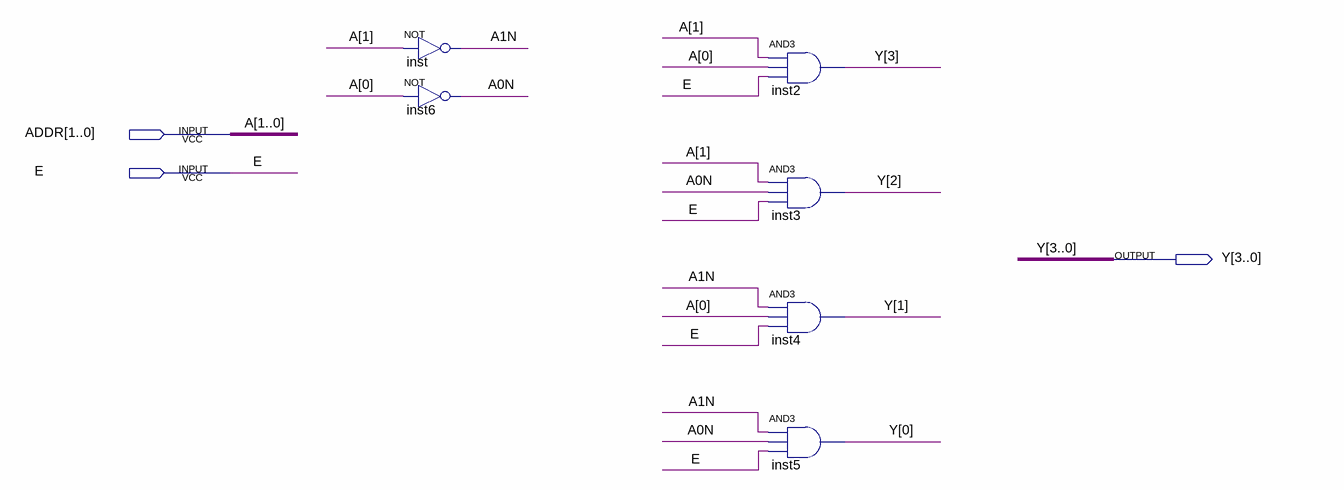
[diagram p0: schematic sheet]
// Quartus schematic DECODER_2_TO_4.bdf as structural Verilog: 6 symbols, 3 pins
module DECODER_2_TO_4 (
  input  [1:0] ADDR,
  input  E,
  output [3:0] Y
);

  wire A0N, A1N;

  not inst (A1N, ADDR[1]);
  not inst6 (A0N, ADDR[0]);
  and inst2 (Y[3], ADDR[1], ADDR[0], E);
  and inst3 (Y[2], ADDR[1], A0N, E);
  and inst4 (Y[1], A1N, ADDR[0], E);
  and inst5 (Y[0], A1N, A0N, E);

  // Other names for the same wires on the sheet: A[1:0] = ADDR
endmodule
